# Altium schematic sheet Roseta_Switches.SchDoc
size A4
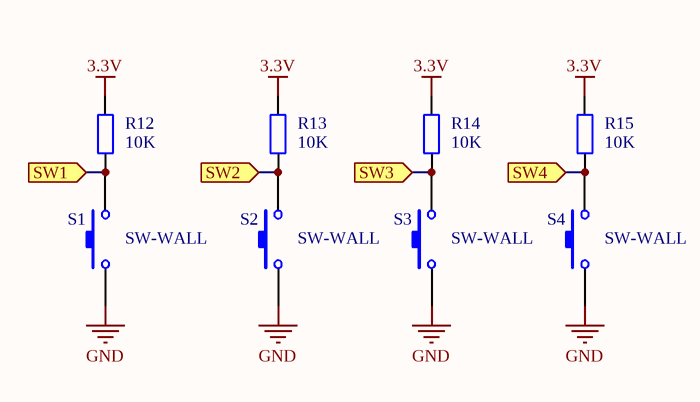
[diagram p0: Roseta_Switches.SchDoc]

## Parts
R12  value 10K  [1608[0603]]  (hidden comment: Res2)
R13  value 10K  [1608[0603]]  (hidden comment: Res2)
R14  value 10K  [1608[0603]]  (hidden comment: Res2)
R15  value 10K  [1608[0603]]  (hidden comment: Res2)
S1  SW-WALL  [TERMINAL BLOCK X2]
S2  SW-WALL  [TERMINAL BLOCK X2]
S3  SW-WALL  [TERMINAL BLOCK X2]
S4  SW-WALL  [TERMINAL BLOCK X2]

## Ports
SW1 (in), SW2 (in), SW3 (in), SW4 (in)

## Nets
3.3V: R12.1 R13.1 R14.1 R15.1
GND: S1.1 S2.1 S3.1 S4.1
SW1: R12.2 S1.2 ; port SW1
SW2: R13.2 S2.2 ; port SW2
SW3: R14.2 S3.2 ; port SW3
SW4: R15.2 S4.2 ; port SW4

## Library data of the parts
R12-R15 = Res2: Resistor; Published: 8-Jun-2000; LatestRevisionDate: 17-Jul-2002; LatestRevisionNote: Re-released for DXP Platform.; PackageReference: AXIAL-0.4; Publisher: Altium Limited
S1-S4 = SW-PB: Switch; Published: 24-Mar-1999; LatestRevisionDate: 17-Jul-2002; LatestRevisionNote: Re-released for DXP Platform.; PackageReference: SPST-2; Publisher: Altium Limited